# EAGLE design schematic (EAGLE 8.6.3)
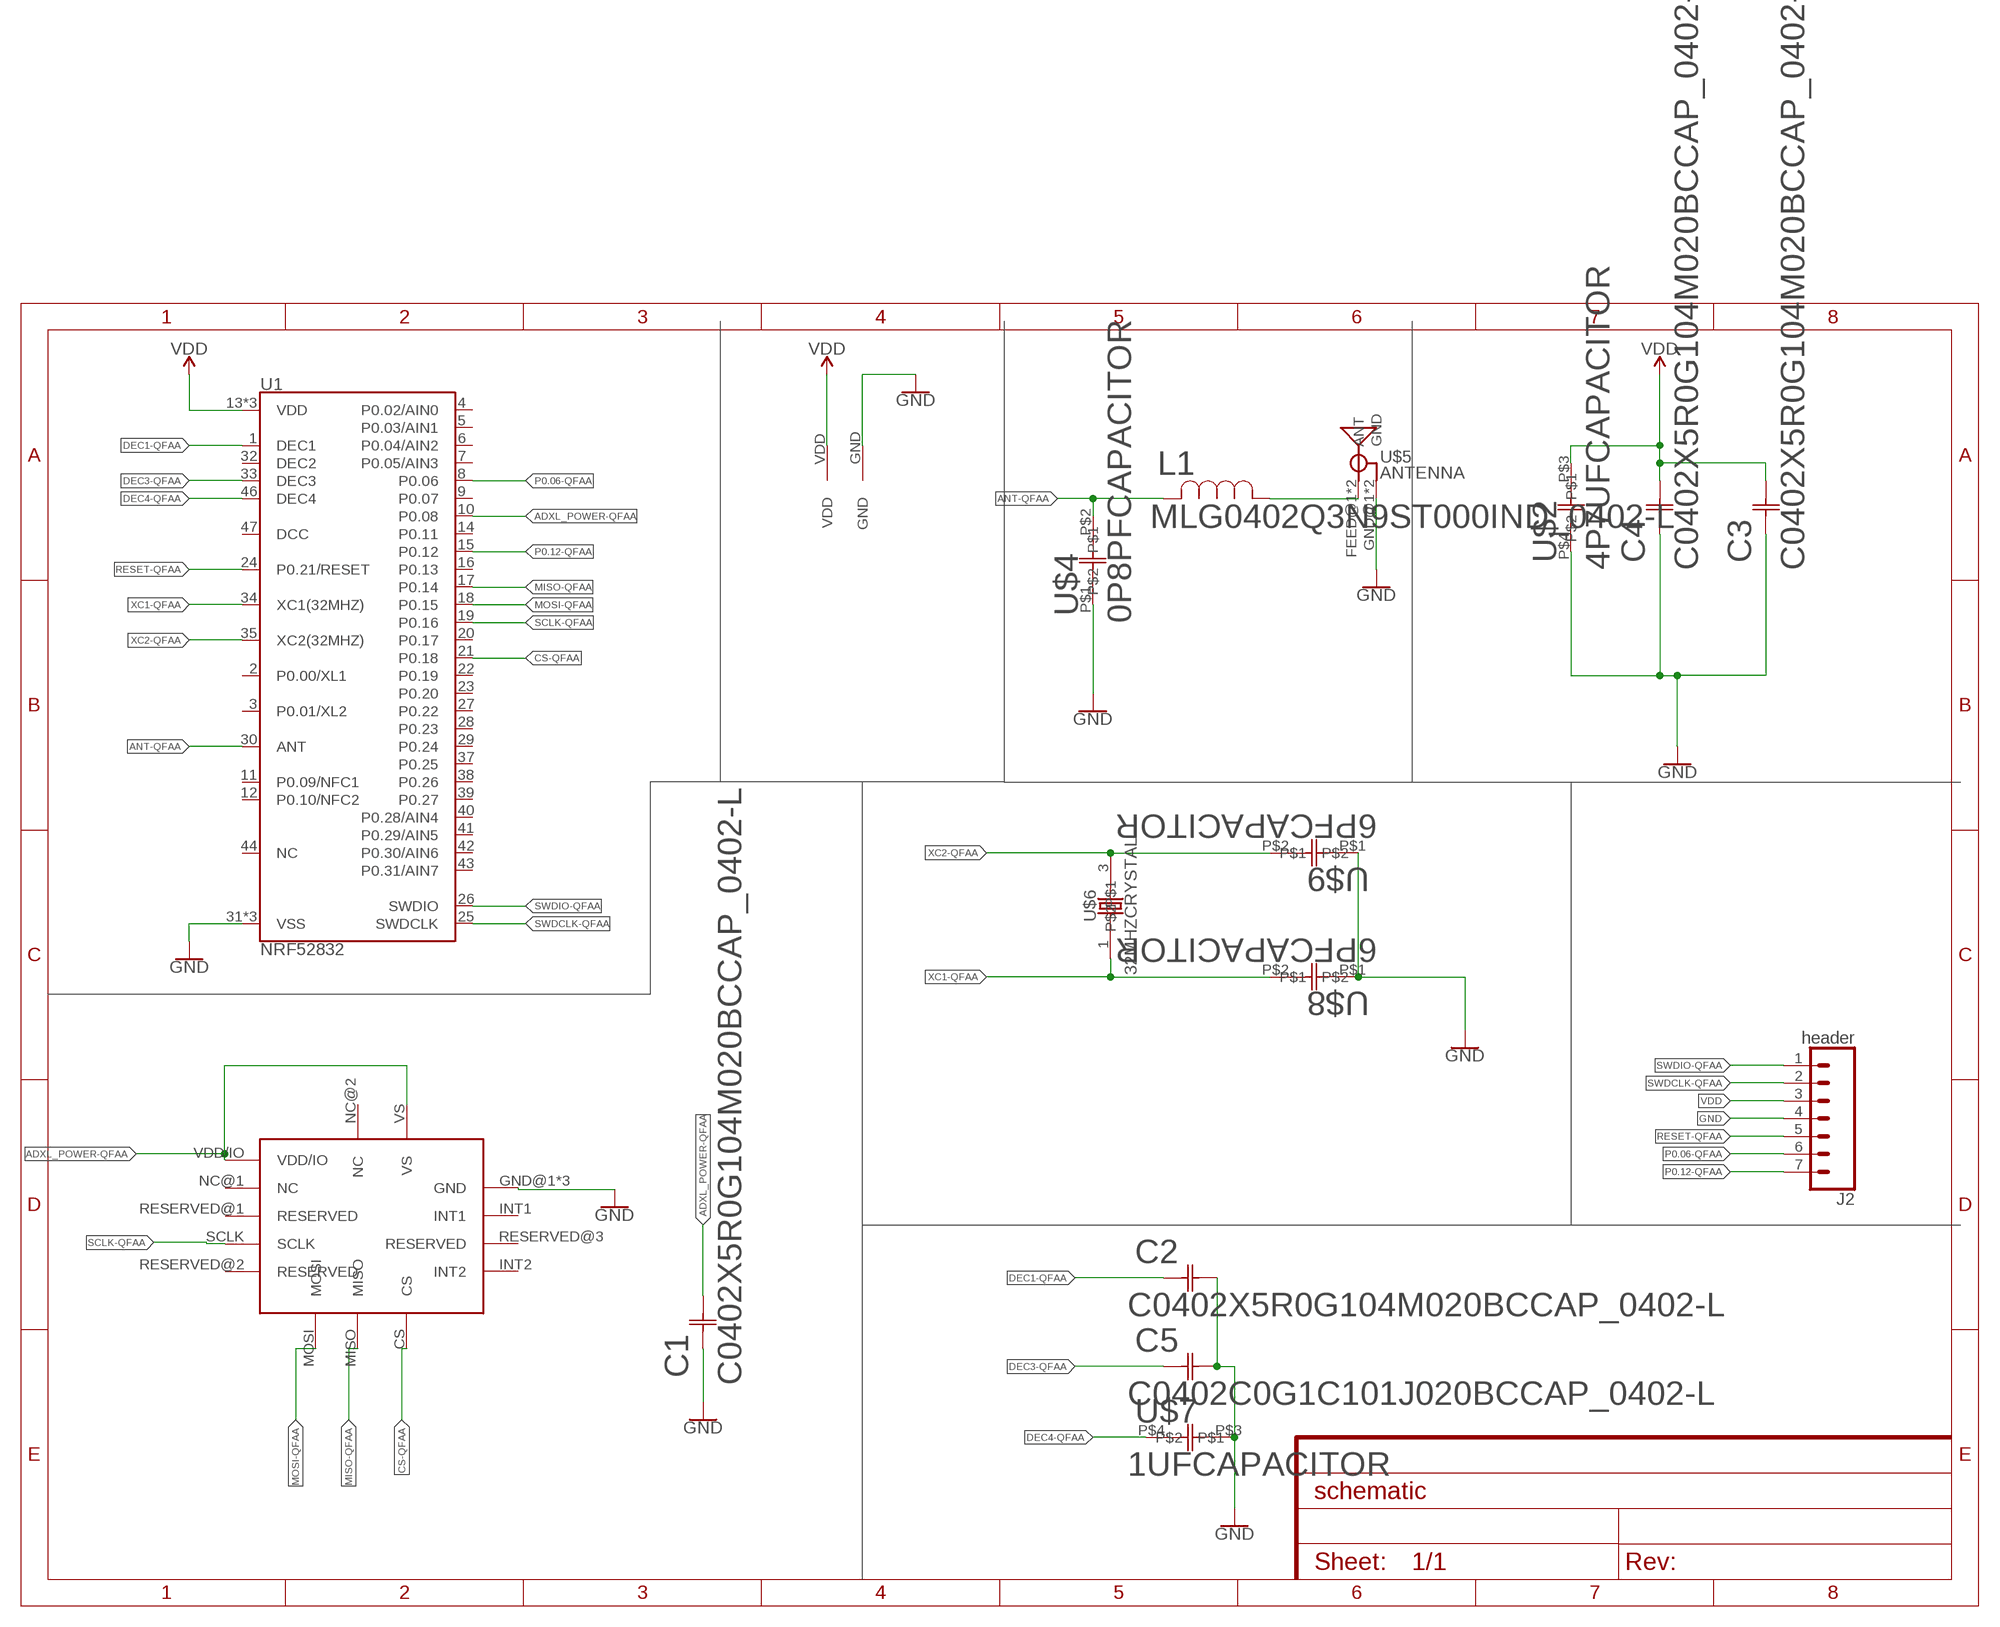
[diagram p0: schematic, sheet 1]

## Parts
C1  C0402X5R0G104M020BCCAP_0402-L  [CAP_0402-L]
C2  C0402X5R0G104M020BCCAP_0402-L  [CAP_0402-L]
C3  C0402X5R0G104M020BCCAP_0402-L  [CAP_0402-L]
C4  C0402X5R0G104M020BCCAP_0402-L  [CAP_0402-L]
C5  C0402C0G1C101J020BCCAP_0402-L  [CAP_0402-L]
J2  header  CONN_07  [1X07]
L1  MLG0402Q3N9ST000IND_0402-L  [IND_0402-L]
U1  NRF52832  [QFN48-6X6MM]
U$1  ADXL362  [TFLGA-16/3.3MMX3.1MM]
U$2  4P7UFCAPACITOR  [4P7UFCAPACITOR]
U$4  0P8PFCAPACITOR  [0P8PFCAPACITOR]
U$5  ANTENNA  [ANTENNA_FOOTPRINT]
U$6  32MHZCRYSTAL  [32MHZCRYSTAL]
U$7  1UFCAPACITOR  [1UFCAPACITOR]
U$8  6PFCAPACITOR  [6PFCAPACITOR]
U$9  6PFCAPACITOR  [6PFCAPACITOR]
U$10  POWER  [POWER]

## Nets
ADXL_POWER-QFAA: C1.2 U1.10(P0.08) U$1.VDD/IO U$1.VS
ANT-QFAA: L1.2 U1.30(ANT) U$4.P$2
CS-QFAA: U1.21(P0.18) U$1.CS
DEC1-QFAA: C2.1 U1.1(DEC1)
DEC3-QFAA: C5.1 U1.33(DEC3)
DEC4-QFAA: U1.46(DEC4) U$7.P$4
GND: C1.1 C2.2 C3.1 C4.1 C5.2 J2.4 U1.31(VSS) U1.45(VSS) U1.EP(VSS) U$1.GND@1(GND) U$1.GND@2(GND) U$1.GND@3(GND) U$2.P$4 U$4.P$1 U$5.GND@1(GND) U$5.GND@2(GND) U$7.P$3 U$8.P$1 U$9.P$1 U$10.GND
MISO-QFAA: U1.17(P0.14) U$1.MISO
MOSI-QFAA: U1.18(P0.15) U$1.MOSI
N$1: L1.1 U$5.FEED@1(ANT) U$5.FEED@2(ANT)
P0.06-QFAA: J2.6 U1.8(P0.06)
P0.12-QFAA: J2.7 U1.15(P0.12)
RESET-QFAA: J2.5 U1.24(P0.21/RESET)
SCLK-QFAA: U1.19(P0.16) U$1.SCLK
SWDCLK-QFAA: J2.2 U1.25(SWDCLK)
SWDIO-QFAA: J2.1 U1.26(SWDIO)
VDD: C3.2 C4.2 J2.3 U1.13(VDD) U1.36(VDD) U1.48(VDD) U$2.P$3 U$10.VDD
XC1-QFAA: U1.34(XC1(32MHZ)) U$6.1 U$8.P$2
XC2-QFAA: U1.35(XC2(32MHZ)) U$6.3 U$9.P$2
Unconnected: U1.2(P0.00/XL1) U1.3(P0.01/XL2) U1.4(P0.02/AIN0) U1.5(P0.03/AIN1) U1.6(P0.04/AIN2) U1.7(P0.05/AIN3) U1.9(P0.07) U1.11(P0.09/NFC1) U1.12(P0.10/NFC2) U1.14(P0.11) U1.16(P0.13) U1.20(P0.17) U1.22(P0.19) U1.23(P0.20) U1.27(P0.22) U1.28(P0.23) U1.29(P0.24) U1.32(DEC2) U1.37(P0.25) U1.38(P0.26) U1.39(P0.27) U1.40(P0.28/AIN4) U1.41(P0.29/AIN5) U1.42(P0.30/AIN6) U1.43(P0.31/AIN7) U1.44(NC) U1.47(DCC) U$1.INT1 U$1.INT2 U$1.NC@1(NC) U$1.NC@2(NC) U$1.RESERVED@1(RESERVED) U$1.RESERVED@2(RESERVED) U$1.RESERVED@3(RESERVED)

## Library data of the parts
C1-C4 = 0p1_uF_capacitor:C0402X5R0G104M020BC; MANUFACTURER_PART_NUMBER: C0402C0G1C101J020BC; VENDOR: TDK
C5 = 100_pF_capacitor:C0402C0G1C101J020BC; MANUFACTURER_PART_NUMBER: C0402C0G1C101J020BC; VENDOR: TDK
J2 = SparkFun-Connectors:CONN_07: Multi connection point. Often used as Generic Header-pin footprint for 0.1 inch spaced/style header connections On any of the 0.1 inch spaced packages, you can populate with these: Break Away Headers - Straight <https://www.sparkfun.com/products/116> (PRT-00116) Break Away Male Headers - Right Angle <https://www.sparkfun.com/products/553> (PRT-00553) Female Headers <https://www.sparkfun.com/products/115> (PRT-00115) Break Away Headers - Machine Pin <https://www.sparkfun.com/products/117> (PRT-00117) Break Away Female Headers - Swiss Machine Pin <https://www.sparkfun.com/products/743> (PRT-00743) For SCREWTERMINALS and SPRING TERMINALS visit here: Screw Terimnals on SparkFun.com <https://www.sparkfun.com/search/results?term=Screw+Terminals> (5mm/3.5mm/2.54mm spacing) This device is also useful as a general connection point to wire up your design to another part of your project. Our various solder wires solder well into these plated through hole pads. Hook-Up Wire - Assortment (Stranded, 22 AWG) <https://www.sparkfun.com/products/11375> (PRT-11375) Hook-Up Wire - Assortment (Solid Core, 22 AWG) <https://www.sparkfun.com/products/11367> (PRT-11367) View the entire wire category on our website here <https://www.sparkfun.com/categories/141> Special notes: Molex polarized connector foot print use with SKU : PRT-08231 with associated crimp pins and housings. 1MM SMD Version SKU: PRT-10208 NOTES ON THE VARIANTS LOCK and LOCK_LONGPADS... This footprint was designed to help hold the alignment of a through-hole component (i.e. 6-pin header) while soldering it into place. You may notice that each hole has been shifted either up or down by 0.005 of an inch from it's more standard position (which is a perfectly straight line). This slight alteration caused the pins (the squares in the middle) to touch the edges of the holes. Because they are alternating, it causes a "brace" to hold the component in place. 0.005 has proven to be the perfect amount of "off-center" position when using our standard breakaway headers. Although looks a little odd when you look at the bare footprint, once you have a header in there, the alteration is very hard to notice. Also,if you push a header all the way into place, it is covered up entirely on the bottom side.
L1 = 3p9_nH_inductor:MLG0402Q3N9ST000; MANUFACTURER_PART_NUMBER: MLG0402Q3N9ST000; VENDOR: TDK
U1 = nrf52832-breakout-temp:NRF52832: Nordic nRF52832 Bluetooth Smart/ANT/2.4GHz RF SoC The nRF52832 SoC is a powerful, highly flexible ultra-low power multiprotocol SoC ideally suited for Bluetooth® Smart ANT and 2.4GHz ultra low-power wireless applications. The nRF52832 SoC is built around a 32-bit ARM® Cortex™-M4F CPU with 512kB + 64kB RAM. The embedded 2.4GHz transceiver supports Bluetooth Smart, ANT and proprietary 2.4 GHz protocol stack. It is on air compatible with the nRF51 Series, nRF24L and nRF24AP Series products from Nordic Semiconductor. Product Page <https://www.nordicsemi.com/eng/Products/Bluetooth-low-energy2/nRF52832>; PROD_ID: IC-13460
U$1 = ADXL362:ADXL362
U$2 = 4p7_uF_capacitor:4P7UFCAPACITOR
U$4 = 0p8_pF_capacitor:0P8PFCAPACITOR
U$5 = 2p4_ghz_antenna:ANTENNA
U$6 = 32_mhz_crystal:32MHZCRYSTAL
U$7 = 1_uF_capacitor:1UFCAPACITOR
U$8 U$9 = 6_pF_capacitor:6PFCAPACITOR
U$10 = power:POWER

## Board
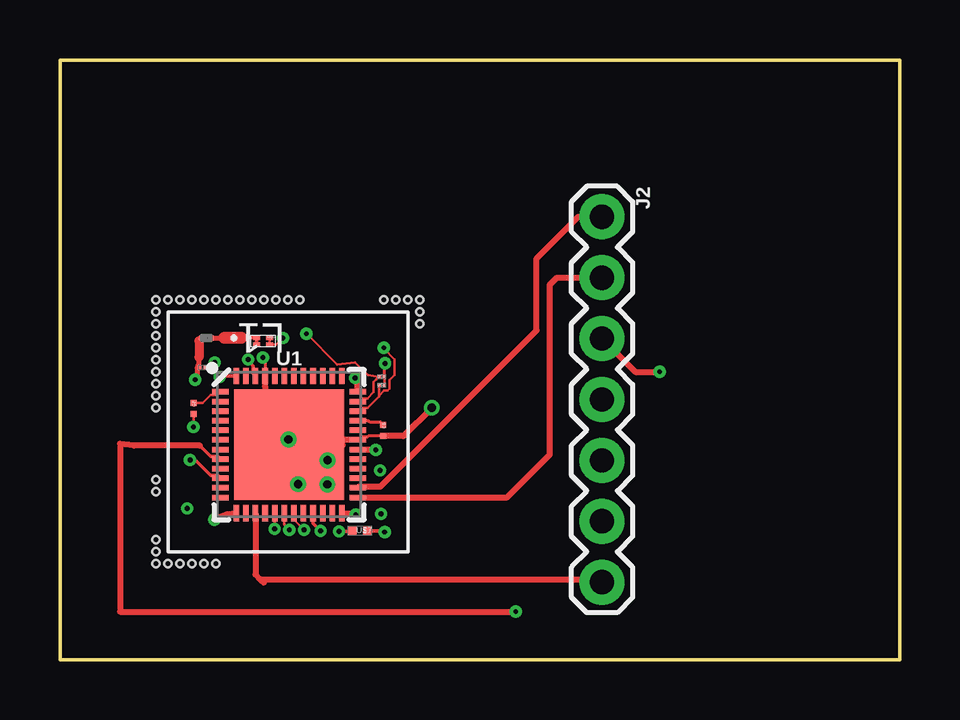
[diagram p1: board, top side]
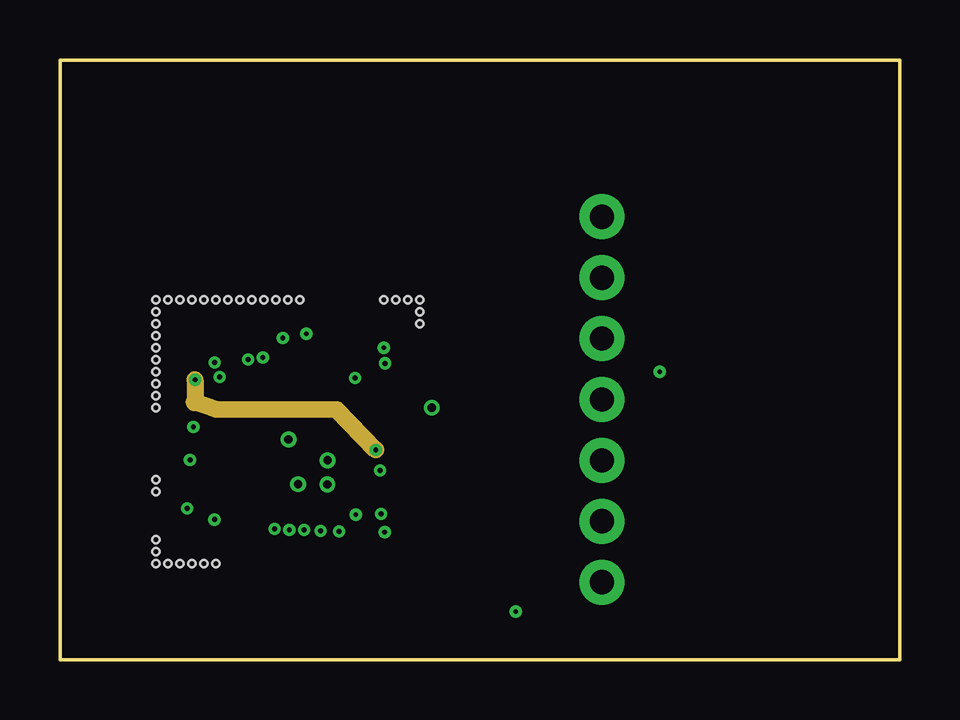
[diagram p2: board, inner layer Route4]
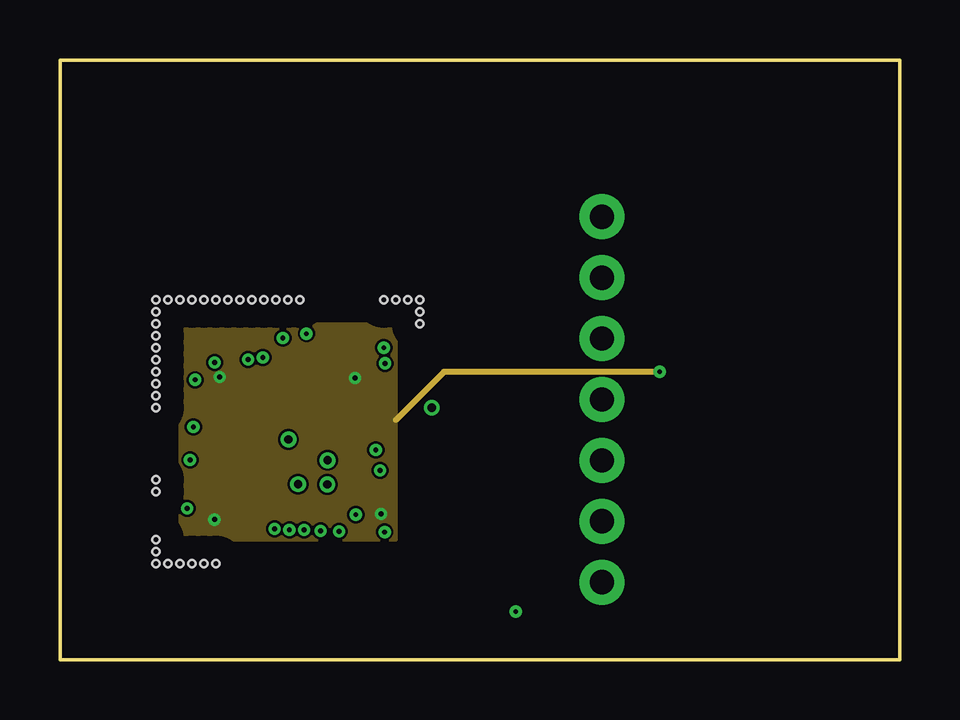
[diagram p3: board, inner layer Route8]
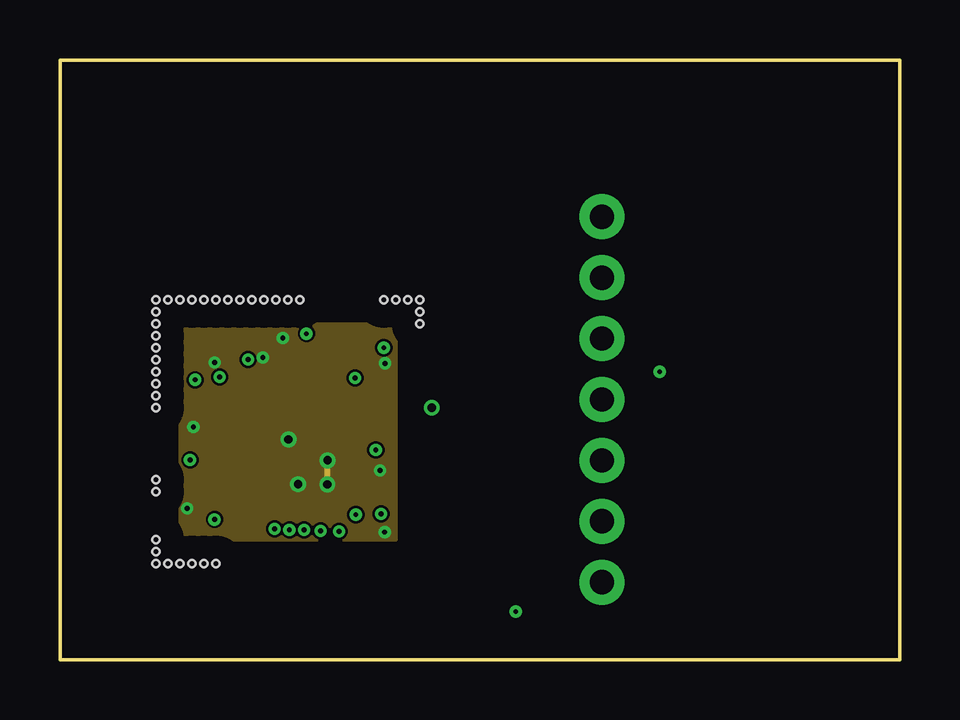
[diagram p4: board, inner layer Route10]
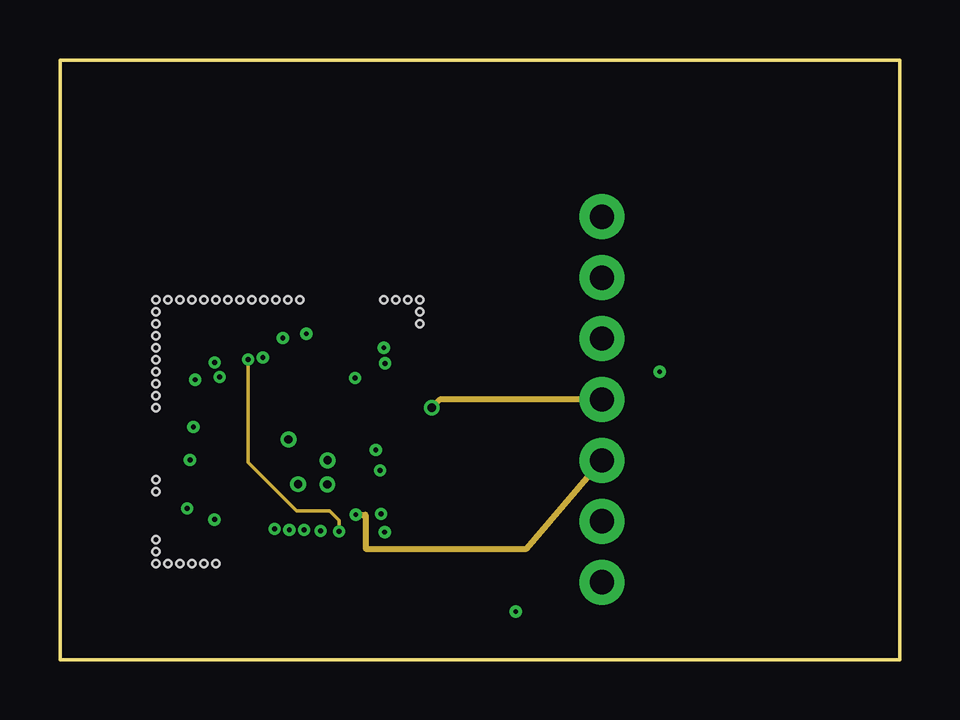
[diagram p5: board, inner layer Route12]
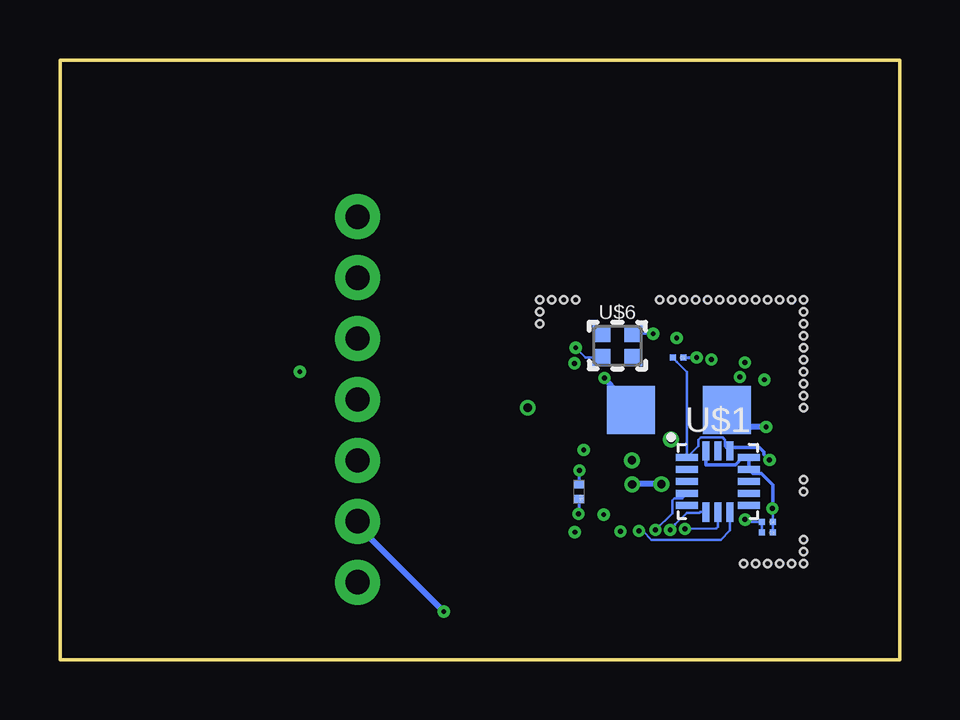
[diagram p6: board, bottom side, seen from below]

Size 35 x 25 mm. Coordinates in mm from the lower left corner, seen from the top.
Outline: 0,0 0,25 35,25 35,0 0,0
Copper layers (((1*4)*8*10)*(12*16)): Top 0.035mm / dielectric 0.25mm / Route4 0.035mm / dielectric 0.31mm / Route8 0.035mm / dielectric 0.25mm / Route10 0.035mm / dielectric 0.31mm / Route12 0.035mm / dielectric 0.25mm / Bottom 0.035mm
Design rules "default *": minimum track width 4mil, minimum drill 8mil, track to track 4mil, track to pad 4mil, pad to pad 4mil, via to via 4mil, smd to smd 2mil, copper to edge 40mil, drill to drill 6mil, minimum pad ring 10mil, minimum via ring 6mil, stop-mask expansion 4mil, vias tented up to drill 0mil, thermal gap 10mil
Holes 0.3 mm at 4,14.5 4,14 4,13.5 4,13 4,12.5 4,12 4,11.5 4,11 4,10.5 4,7.5 4,7 4,5 4,4.5 4,4 4.5,4 5,4 5.5,4 6,4 6.5,4 4,15 4.5,15 5,15 5.5,15 6,15 6.5,15 7,15 7.5,15 8,15 8.5,15 9,15 9.5,15 10,15 13.5,15 14,15 14.5,15 15,15 15,14.5 15,14

### Footprints (pad centres in the part's own frame; a part is rotated, then mirrored left to right if it is on the bottom)
CAP_0402-L = smd 0.25 x 0.25: 1 -0.229,0; 2 0.229,0
1X07 = drill 1.016 pad 1.88: 1 0,0; 2 2.54,0; 3 5.08,0; 4 7.62,0; 5 10.16,0; 6 12.7,0; 7 15.24,0
IND_0402-L = smd 0.212 x 0.2: 1 -0.196,0; 2 0.196,0
QFN48-6X6MM = smd 0.68 x 0.23: 1 -2.86,2.2; 2 -2.86,1.8; 3 -2.86,1.4; 4 -2.86,1; 5 -2.86,0.6; 6 -2.86,0.2; 7 -2.86,-0.2; 8 -2.86,-0.6; 9 -2.86,-1; 10 -2.86,-1.4; 11 -2.86,-1.8; 12 -2.86,-2.2; 25 2.86,-2.2; 26 2.86,-1.8; 27 2.86,-1.4; 28 2.86,-1; 29 2.86,-0.6; 30 2.86,-0.2; 31 2.86,0.2; 32 2.86,0.6; 33 2.86,1; 34 2.86,1.4; 35 2.86,1.8; 36 2.86,2.2 | smd 0.23 x 0.68: 13 -2.2,-2.86; 14 -1.8,-2.86; 15 -1.4,-2.86; 16 -1,-2.86; 17 -0.6,-2.86; 18 -0.2,-2.86; 19 0.2,-2.86; 20 0.6,-2.86; 21 1,-2.86; 22 1.4,-2.86; 23 1.8,-2.86; 24 2.2,-2.86; 37 2.2,2.86; 38 1.8,2.86; 39 1.4,2.86; 40 1,2.86; 41 0.6,2.86; 42 0.2,2.86; 43 -0.2,2.86; 44 -0.6,2.86; 45 -1,2.86; 46 -1.4,2.86; 47 -1.8,2.86; 48 -2.2,2.86 | smd 4.6 x 4.6: EP 0,0
TFLGA-16/3.3MMX3.1MM = smd 0.3 x 0.8: CS 0.5,-1.275; GND@3 -0.5,1.275; MISO 0,-1.275; MOSI -0.5,-1.275; NC@2 0,1.275; VS 0.5,1.275 | smd 0.925 x 0.3: GND@1 1.288,0.5; GND@2 1.288,1; INT1 1.288,0; INT2 1.288,-1; NC@1 -1.288,0.5; RESERVED@1 -1.288,0; RESERVED@2 -1.288,-1; RESERVED@3 1.288,-0.5; SCLK -1.288,-0.5; VDD/IO -1.288,1
4P7UFCAPACITOR = smd 0.35 x 0.4: P$3 0.18,0.15; P$4 0.8,0.15
0P8PFCAPACITOR = smd 0.125 x 0.15: P$1 0.034,0.075; P$2 0.27,0.075
ANTENNA_FOOTPRINT = smd 0.3 x 0.2: FEED@1 0.77,0.1; FEED@2 0.77,0.4; GND@1 0.23,0.1; GND@2 0.23,0.4
32MHZCRYSTAL = smd 0.75 x 0.7: 1 0.485,0.47; 2 1.835,0.47; 3 1.835,1.47; 4 0.485,1.47
1UFCAPACITOR = smd 0.35 x 0.4: P$3 0.18,0.15; P$4 0.8,0.15
6PFCAPACITOR = smd 0.125 x 0.15: P$1 0.034,0.075; P$2 0.27,0.075
POWER = smd 2 x 2: GND 5,1; VDD 1,1

### Placement (x,y rotation side)
C1  9.23,12.6 180 bottom
C2  5.57,10.47 270 top
C3  5.52,5.3 180 bottom
C4  5.51,5.74 180 bottom
C5  13.48,9.55 270 top
J2  22.6,18.46 270 top
L1  6.11,13.41 180 top
U1  9.55,8.96 0 top
U$1  7.57,7.42 0 bottom
U$2  13.21,6.51 90 bottom
U$4  6.09,12.25 180 top
U$5  8.96,13.53 180 top
U$6  12.92,12.12 0 bottom
U$7  13,5.52 180 top
U$8  13.56,11.52 180 top
U$9  13.57,11.87 180 top
U$10  12.2,9.41 0 bottom

### Tracks (layer width: path | path; a pad name or v marks a point on that pad's centre or on a via)
ADXL_POWER-QFAA  (via drill 0.2)
  Top 0.152: U1.10 6.58,7.67 6.28,7.67 5.63,8.32 v5.42,8.32
  Bottom 0.102: U$1.VS 7.22,8.84 7.27,8.9 7.27,9.16 7.36,9.25 8.29,9.25 8.38,9.16 8.38,8.91 U$1.VDD/IO 8.86,11.99 9.28,12.41 9.28,12.42 C1.2
  Bottom 0.152: v5.42,8.32 5.65,8.54 5.65,8.65 5.84,8.84 7.22,8.84
ANT-QFAA  (via drill 0.2)
  Top 0.127: U$4.P$2 5.72,12.14
  Top 0.203: 5.8,12.8 5.8,12.6 5.8,12.34 5.79,12.34 5.72,12.14 5.72,11.76 v5.63,11.66
  Top 0.254: v13.17,8.74 12.43,8.74 12.42,8.75 | 12.42,8.75 12.41,8.75 | U1.30 12.42,8.75 | L1.2 5.8,13.29
  Top 0.381: 5.8,13.29 5.8,12.6
  Route4 0.711: v13.17,8.74 11.54,10.42 6.49,10.45 5.6,10.77 5.6,10.7 5.63,10.73 v5.63,11.66
CS-QFAA  (via drill 0.2)
  Top 0.152: U1.21 10.55,5.67 v10.87,5.36
  Bottom 0.102: v10.87,5.36 10.71,5.36 10.34,5 7.46,5 7.07,5.38 7.07,5.39 U$1.CS
DEC1-QFAA
  Top 0.102: U1.1 6.56,11.03 6.29,11.03 5.96,10.7 C2.1
DEC3-QFAA
  Top 0.127: U1.33 12.86,9.96 12.91,9.91 13.35,9.91 C5.1
DEC4-QFAA  (via drill 0.2)
  Top 0.152: U1.46 8.04,11.93 8.04,12.23 7.85,12.43 v7.85,12.52 | v11.63,5.34 12.17,5.34 U$7.P$4
  Route12 0.152: v7.85,12.52 7.85,8.22 9.87,6.2 11.24,6.2 11.63,5.81 v11.63,5.34
GND  (via drill 0.2, 0.35)
  Top 0.102: U$4.P$1 6.25,12.18 v6.45,12.39 | U$5.GND@1 U$5.GND@2 9.02,13.13 v9.29,13.4 | U$9.P$1 U$8.P$1 | C2.2 v5.57,9.7 v5.56,9.69
  Top 0.127: v8.46,12.6 8.55,12.5 U1.45 | U$9.P$1 13.53,12.34 v13.55,12.35 | C5.2 12.86,9.32 12.82,9.28 12.53,9.28 U1.31
  Top 0.152: 11.45,8.96 U1.EP | U$7.P$3 13.48,5.37 v13.54,5.31
  Top 0.203: U1.45 8.55,11.4 | v9.53,9.18 U1.EP
  Top 0.254: v15.5,10.5 14.32,9.32 C5.2 | U1.31 11.78,9.16 | 11.78,9.16 11.65,9.16 11.45,8.96 | 8.55,11.4 8.55,9.96 v9.53,9.18 | U1.EP 9.93,8.58 v9.93,7.32 | v11.15,8.31 11.78,8.93 11.78,9.16
  Route10 0.102: v6.45,12.39 6.45,12.35
  Route10 0.254: 11.13,7.23 11.13,7.28 v11.15,7.3 v11.15,8.3 v11.15,8.31
  Route12 0.254: J2.4 15.84,10.84 v15.5,10.5
  Bottom 0.102: C3.1 C4.1 5.28,6.28 v5.3,6.3
  Bottom 0.127: C1.1 v8.46,12.6 | U$2.P$4 13.35,7.33 v13.35,7.89
  Bottom 0.152: 5.59,9.72 v5.56,9.69 | 5.28,6.28 5.28,7.29 5.75,7.75 6.11,7.75 U$1.GND@1 U$1.GND@2 6.55,8.42 6.85,8.12 7.8,8.12 8.08,8.12 8.07,8.13 U$1.GND@3
  Bottom 0.254: U$10.GND 6.51,9.72 5.59,9.72 | v9.93,7.32 11.14,7.32 v11.15,7.3
  pour Route10: 5,5 14,5 14,14 5,14
MISO-QFAA  (via drill 0.2 pad 0.51)
  Top 0.102: U1.17 8.95,5.46 v8.95,5.45
  Bottom 0.102: v8.95,5.45 7.64,5.46 7.57,5.52 U$1.MISO
MOSI-QFAA  (via drill 0.2 pad 0.51)
  Top 0.102: U1.18 9.35,5.64 9.36,5.63 9.36,5.61 v9.56,5.4
  Bottom 0.102: v9.56,5.4 9.36,5.61 9.36,5.63 8.87,6.12 8.34,6.12 8.31,6.15 U$1.MOSI
N$1
  Top 0.152: 7.37,13.43 7.56,13.43 U$5.FEED@1 U$5.FEED@2
  Top 0.203: L1.1 6.85,13.41
  Top 0.254: 8.19,13.14 U$5.FEED@2
  Top 0.508: 6.85,13.41 6.87,13.43 7.56,13.43
P0.06-QFAA  (via drill 0.2)
  Top 0.152: U1.8 6.58,8.47 6.28,8.47 6.17,8.57 6.17,8.58 5.83,8.93
  Top 0.254: 5.83,8.93 3.07,8.93 2.5,9 2.5,2 v19,2
  Bottom 0.254: v19,2 22.6,5.6 J2.6
P0.12-QFAA
  Top 0.254: U1.15 8.15,3.55 8.35,3.35 | 8.35,3.35 8.5,3.2 | 8.35,3.35 22.47,3.35 J2.7
RESET-QFAA  (via drill 0.2)
  Top 0.254: U1.24 12.28,6.1 v12.33,6.04
  Route12 0.254: v12.33,6.04 12.74,6.04 12.74,4.62 19.45,4.62 J2.5
SCLK-QFAA  (via drill 0.2 pad 0.51)
  Top 0.102: U1.19 9.75,5.83 v10.17,5.4
  Bottom 0.102: v10.17,5.4 9.48,6.1 9.48,6.64 9.39,6.73 9.06,6.73 U$1.SCLK
SWDCLK-QFAA
  Top 0.254: U1.25 18.63,6.76 20.42,8.55 20.42,15.63 20.72,15.92 J2.2
SWDIO-QFAA
  Top 0.254: U1.26 12.47,7.22 13.36,7.22 19.87,13.72 19.87,16.73 21.61,18.46 J2.1
VDD  (via drill 0.2, 0.2 pad 0.51)
  Top 0.152: U1.48 6.72,11.82 v6.65,11.78
  Top 0.254: U1.13 7,6.06 v6.44,5.84 | J2.3 23.98,12 v25,12 | U1.36 12.41,11.61 v12.3,11.73
  Route8 0.254: v25,12 16,12 14,10
  Bottom 0.102: v6.44,5.84 6.35,5.74 C4.2 C3.2
  Bottom 0.127: U$2.P$3 13.36,6.1 v13.38,6.08
  Bottom 0.254: U$10.VDD 11.2,10.52 v12.3,11.73
  pour Route8: 5,5 14,5 14,14 5,14
XC1-QFAA  (via drill 0.2)
  Top 0.102: 12.44,10.33 U1.34 12.54,10.49 12.81,10.49 13.29,10.97 13.29,11 | 13.29,11 U$8.P$2 | 13.29,11 13.51,11.22 13.66,11.22 13.75,11.31 13.75,11.65 13.95,11.86 13.95,12.52 13.5,12.97 v13.5,13
  Bottom 0.102: v13.5,13 13.09,12.59 U$6.1
XC2-QFAA  (via drill 0.2)
  Top 0.102: U1.35 12.54,10.89 12.81,10.89 13.08,11.16 13.08,11.58 13.17,11.67 13.18,11.67 U$9.P$2 12.83,11.87 12.31,12.39 11.55,12.31 v10.27,13.59
  Bottom 0.102: v10.27,13.59 v10.28,13.59 U$6.3